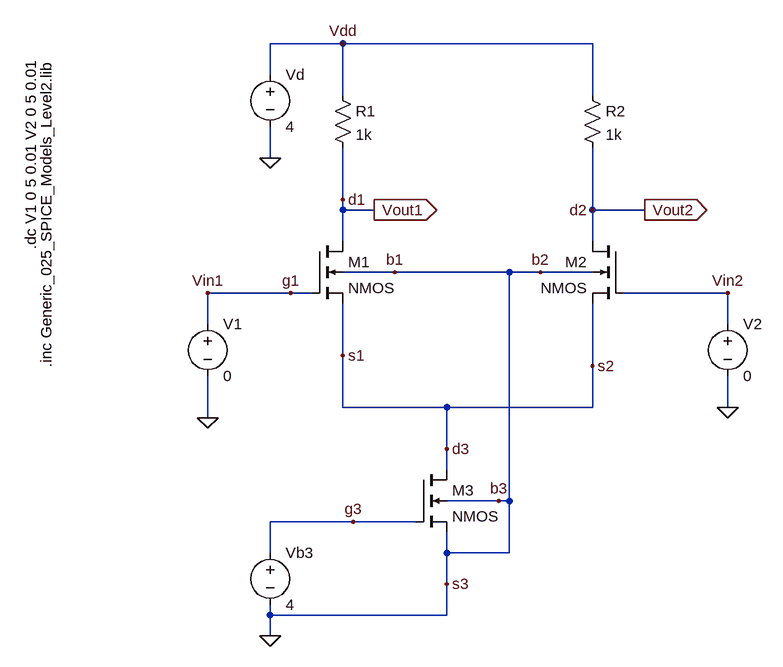
[diagram p0: schematic circuito_3.asc]
circuito_3.asc, the LTspice schematic file:
Version 4
SHEET 1 2972 692
WIRE 160 -240 48 -240
WIRE 544 -240 160 -240
WIRE 48 -192 48 -240
WIRE 160 -160 160 -240
WIRE 544 -160 544 -240
WIRE 48 -64 48 -112
WIRE 160 0 160 -80
WIRE 160 16 160 0
WIRE 208 16 160 16
WIRE 544 16 544 -80
WIRE 624 16 544 16
WIRE 160 64 160 16
WIRE 544 64 544 16
WIRE 240 112 160 112
WIRE 416 112 240 112
WIRE 464 112 416 112
WIRE 544 112 464 112
WIRE 80 144 -48 144
WIRE 112 144 80 144
WIRE 752 144 592 144
WIRE -48 192 -48 144
WIRE 752 192 752 144
WIRE 160 240 160 160
WIRE 544 256 544 160
WIRE 160 320 160 240
WIRE 320 320 160 320
WIRE 544 320 544 256
WIRE 544 320 320 320
WIRE 752 320 752 272
WIRE -48 336 -48 272
WIRE 320 384 320 320
WIRE 320 416 320 384
WIRE 400 464 320 464
WIRE 416 464 416 112
WIRE 416 464 400 464
WIRE 176 496 48 496
WIRE 272 496 176 496
WIRE 48 544 48 496
WIRE 320 544 320 512
WIRE 416 544 416 464
WIRE 416 544 320 544
WIRE 320 592 320 544
WIRE 48 640 48 624
WIRE 320 640 320 592
WIRE 320 640 48 640
WIRE 48 672 48 640
FLAG 48 -64 0
FLAG -48 336 0
FLAG -48 144 Vin1
FLAG 160 -240 Vdd
FLAG 240 112 b1
FLAG 80 144 g1
FLAG 160 0 d1
FLAG 160 240 s1
FLAG 208 16 Vout1
IOPIN 208 16 Out
FLAG 624 16 Vout2
IOPIN 624 16 Out
FLAG 752 320 0
FLAG 752 144 Vin2
FLAG 544 256 s2
FLAG 464 112 b2
FLAG 544 16 d2
FLAG 176 496 g3
FLAG 320 384 d3
FLAG 48 672 0
FLAG 320 592 s3
FLAG 400 464 b3
SYMBOL voltage 48 -208 R0
WINDOW 123 0 0 Left 2
WINDOW 39 0 0 Left 2
SYMATTR InstName Vd
SYMATTR Value 4
SYMBOL voltage -48 176 R0
WINDOW 123 0 0 Left 2
WINDOW 39 0 0 Left 2
SYMATTR InstName V1
SYMATTR Value 0
SYMBOL res 144 -176 R0
SYMATTR InstName R1
SYMATTR Value 1k
SYMBOL nmos4 112 64 R0
SYMATTR InstName M1
SYMATTR Value2 l=0.25u w=40u
SYMBOL res 528 -176 R0
SYMATTR InstName R2
SYMATTR Value 1k
SYMBOL nmos4 592 64 M0
SYMATTR InstName M2
SYMATTR Value2 l=0.25u w=40u
SYMBOL voltage 752 176 R0
WINDOW 123 0 0 Left 2
WINDOW 39 0 0 Left 2
SYMATTR InstName V2
SYMATTR Value 0
SYMBOL nmos4 272 416 R0
SYMATTR InstName M3
SYMATTR Value2 l=0.25u w=40u
SYMBOL voltage 48 528 R0
WINDOW 123 0 0 Left 2
WINDOW 39 0 0 Left 2
SYMATTR InstName Vb3
SYMATTR Value 4
TEXT -296 -216 VRight 2 !.inc Generic_025_SPICE_Models_Level2.lib
TEXT -320 -216 VRight 2 !.dc V1 0 5 0.01 V2 0 5 0.01

The netlist it stands for:
* circuito_3.asc
Vd Vdd 0 4
V1 g1 0 0
R1 Vdd Vout1 1k
M1 Vout1 g1 d3 0 NMOS l=0.25u w=40u
R2 Vdd d2 1k
M2 d2 Vin2 d3 0 NMOS l=0.25u w=40u
V2 Vin2 0 0
M3 d3 g3 0 0 NMOS l=0.25u w=40u
Vb3 g3 0 4
.model NMOS NMOS
.model PMOS PMOS
.lib standard.mos
.inc Generic_025_SPICE_Models_Level2.lib
.dc V1 0 5 0.01 V2 0 5 0.01
.backanno
.end